# Altium project AI Gateway - Carrier.PrjPcb (part 1 of 2)
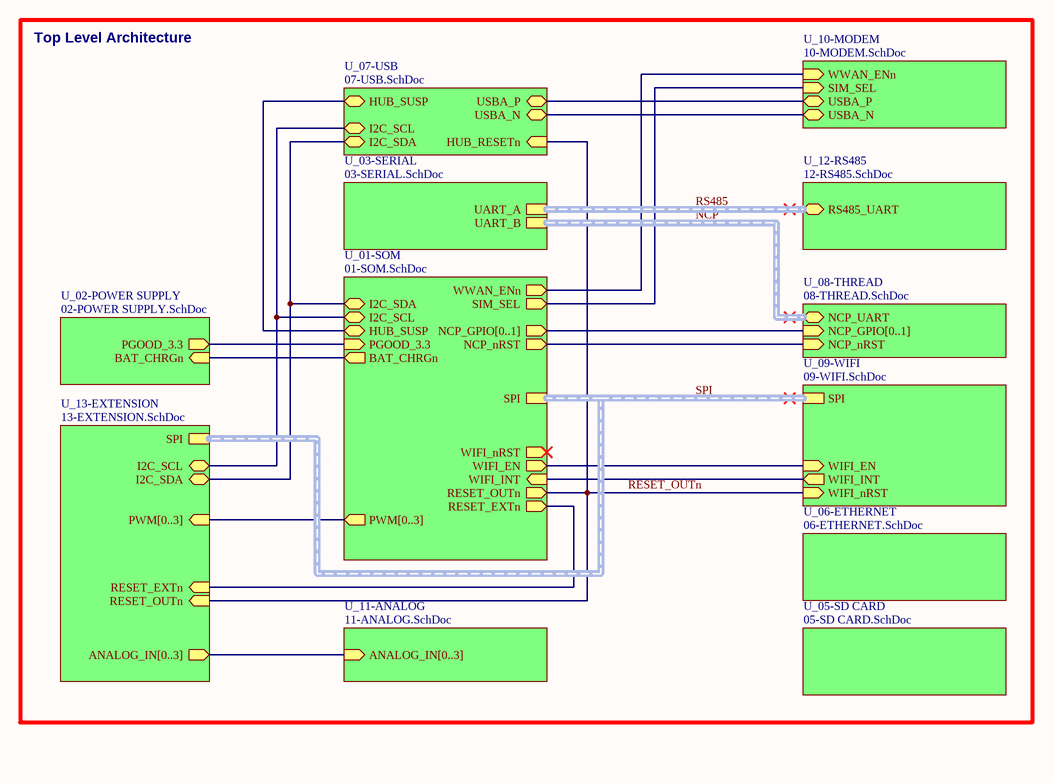
[diagram p0: 00-ARCHITECTURE.SchDoc]
Revision: A
13 sheets, 246 parts. Net scope: hierarchical (ports join the sheet entries above them; power ports are global).
Board file: AI Gateway - Carrier.PcbDoc
Sheets:
  00-ARCHITECTURE.SchDoc
    U_06-ETHERNET = 06-ETHERNET.SchDoc
    U_07-USB = 07-USB.SchDoc
    U_02-POWER SUPPLY = 02-POWER SUPPLY.SchDoc
    U_08-THREAD = 08-THREAD.SchDoc
    U_09-WIFI = 09-WIFI.SchDoc
    U_10-MODEM = 10-MODEM.SchDoc
    U_12-RS485 = 12-RS485.SchDoc
    U_05-SD CARD = 05-SD CARD.SchDoc
    U_03-SERIAL = 03-SERIAL.SchDoc
    U_01-SOM = 01-SOM.SchDoc
    U_11-ANALOG = 11-ANALOG.SchDoc
    U_13-EXTENSION = 13-EXTENSION.SchDoc

## Sheet 00-ARCHITECTURE.SchDoc
size A4

### Sub-sheets
U_01-SOM = 01-SOM.SchDoc: PWM[0..3] (out), RESET_OUTn (out), WIFI_nRST (out), WIFI_INT (in), WWAN_ENn (out), SIM_SEL (out), NCP_nRST (out), WIFI_EN (out), SPI (harness SPI), NCP_GPIO[0..1] (out), I2C_SDA (bidir), I2C_SCL (bidir), RESET_EXTn (out), HUB_SUSP (bidir), BAT_CHRGn (out), PGOOD_3.3 (in)
U_02-POWER SUPPLY = 02-POWER SUPPLY.SchDoc: PGOOD_3.3 (out), BAT_CHRGn (in)
U_03-SERIAL = 03-SERIAL.SchDoc: UART_A (harness UART), UART_B (harness UART)
U_05-SD CARD = 05-SD CARD.SchDoc: no entries
U_06-ETHERNET = 06-ETHERNET.SchDoc: no entries
U_07-USB = 07-USB.SchDoc: USBA_P (bidir), USBA_N (bidir), HUB_SUSP (bidir), HUB_RESETn (in), I2C_SDA (bidir), I2C_SCL (bidir)
U_08-THREAD = 08-THREAD.SchDoc: NCP_GPIO[0..1] (in), NCP_nRST (in), NCP_UART (bidir, harness UART)
U_09-WIFI = 09-WIFI.SchDoc: WIFI_nRST (in), WIFI_INT (out), WIFI_EN (in), SPI (harness SPI)
U_10-MODEM = 10-MODEM.SchDoc: USBA_P (bidir), USBA_N (bidir), SIM_SEL (in), WWAN_ENn (in)
U_11-ANALOG = 11-ANALOG.SchDoc: ANALOG_IN[0..3] (in)
U_12-RS485 = 12-RS485.SchDoc: RS485_UART (bidir, harness UART)
U_13-EXTENSION = 13-EXTENSION.SchDoc: RESET_OUTn (in), SPI (harness SPI), I2C_SDA (bidir), PWM[0..3] (in), RESET_EXTn (in), I2C_SCL (bidir), ANALOG_IN[0..3] (out)

### Nets
BAT_CHRGn: sheet U_02-POWER SUPPLY/BAT_CHRGn, sheet U_01-SOM/BAT_CHRGn
HUB_SUSP: sheet U_07-USB/HUB_SUSP, sheet U_01-SOM/HUB_SUSP
I2C_SCL: sheet U_07-USB/I2C_SCL, sheet U_01-SOM/I2C_SCL, sheet U_13-EXTENSION/I2C_SCL
I2C_SDA: sheet U_07-USB/I2C_SDA, sheet U_01-SOM/I2C_SDA, sheet U_13-EXTENSION/I2C_SDA
NCP_nRST: sheet U_08-THREAD/NCP_nRST, sheet U_01-SOM/NCP_nRST
PGOOD_3.3: sheet U_02-POWER SUPPLY/PGOOD_3.3, sheet U_01-SOM/PGOOD_3.3
RESET_EXTn: sheet U_01-SOM/RESET_EXTn, sheet U_13-EXTENSION/RESET_EXTn
RESET_OUTn: sheet U_07-USB/HUB_RESETn, sheet U_09-WIFI/WIFI_nRST, sheet U_01-SOM/RESET_OUTn, sheet U_13-EXTENSION/RESET_OUTn
SIM_SEL: sheet U_10-MODEM/SIM_SEL, sheet U_01-SOM/SIM_SEL
USBA_N: sheet U_07-USB/USBA_N, sheet U_10-MODEM/USBA_N
USBA_P: sheet U_07-USB/USBA_P, sheet U_10-MODEM/USBA_P
WIFI_EN: sheet U_09-WIFI/WIFI_EN, sheet U_01-SOM/WIFI_EN
WIFI_INT: sheet U_09-WIFI/WIFI_INT, sheet U_01-SOM/WIFI_INT
WWAN_ENn: sheet U_10-MODEM/WWAN_ENn, sheet U_01-SOM/WWAN_ENn

### Buses and harness runs
bus sheet U_01-SOM/NCP_GPIO[0..1] = sheet U_08-THREAD/NCP_GPIO[0..1]
bus sheet U_01-SOM/PWM[0..3] = sheet U_13-EXTENSION/PWM[0..3]
bus sheet U_11-ANALOG/ANALOG_IN[0..3] = sheet U_13-EXTENSION/ANALOG_IN[0..3]
harness NCP = sheet U_03-SERIAL/UART_B = sheet U_08-THREAD/NCP_UART
harness RS485 = sheet U_03-SERIAL/UART_A = sheet U_12-RS485/RS485_UART
harness SPI = sheet U_01-SOM/SPI = sheet U_09-WIFI/SPI = sheet U_13-EXTENSION/SPI

### Notes on the sheet
- Top Level Architecture

## Sheet 06-ETHERNET.SchDoc
size A4
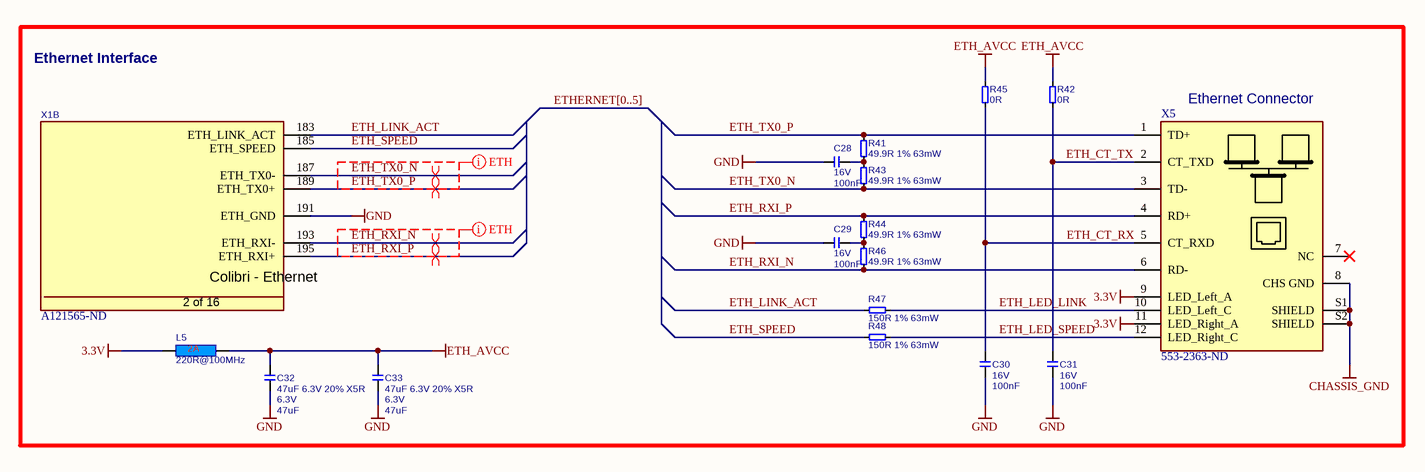
[diagram p1: 06-ETHERNET.SchDoc]

### Parts
C28  value 100nF  Rating: 16V  [CAPC1005X60N]  (hidden comment: 100nF 16V 10% X7R)
C29  value 100nF  Rating: 16V  [CAPC1005X60N]  (hidden comment: 100nF 16V 10% X7R)
C30  value 100nF  Rating: 16V  [CAPC1005X60N]  (hidden comment: 100nF 16V 10% X7R)
C31  value 100nF  Rating: 16V  [CAPC1005X60N]  (hidden comment: 100nF 16V 10% X7R)
C32  47uF 6.3V 20% X5R  value 47uF  Rating: 6.3V  [T_CAPC0603X33N]
C33  47uF 6.3V 20% X5R  value 47uF  Rating: 6.3V  [T_CAPC0603X33N]
L5  value 220R@100MHz  [INDC2012X140N]  (hidden comment: BLM21PG221SN1D)
R41  49.9R 1% 63mW  [RESC1005X40N]
R42  0R  [RESC1005X40N]
R43  49.9R 1% 63mW  [RESC1005X40N]
R44  49.9R 1% 63mW  [RESC1005X40N]
R45  0R  [RESC1005X40N]
R46  49.9R 1% 63mW  [RESC1005X40N]
R47  150R 1% 63mW  [RESC1005X40N]
R48  150R 1% 63mW  [RESC1005X40N]
X1  Supplier Part Number 1: A121565-ND  [T_Tyco_1473005-1]  (hidden comment: 1473005-1)  (part B of 16)
X5  Supplier Part Number 1: 553-2363-ND  [T_PULSE_JD2-0001NL]  (hidden comment: JD2-0001NL)

### Nets
3.3V: L5.2 X5.9(LED_Left_A) X5.11(LED_Right_A)
CHASSIS_GND: X5.8(CHS_GND) X5.S1(SHIELD) X5.S2(SHIELD)
ETH_AVCC: C32.2 C33.2 L5.1 R42.2 R45.2
GND: C28.2 C29.2 C30.1 C31.1 C32.1 C33.1 X1.191(ETH_GND)
ETH_CT_RX: C30.2 R45.1 X5.5(CT_RXD)
ETH_CT_TX: C31.2 R42.1 X5.2(CT_TXD)
ETH_LED_LINK: R47.1 X5.10(LED_Left_C)
ETH_LED_SPEED: R48.1 X5.12(LED_Right_C)
ETH_LINK_ACT: R47.2 X1.183(ETH_LINK_ACT)
ETH_RXI_N: R46.1 X1.193(ETH_RXI-) X5.6(RD-)
ETH_RXI_P: R44.2 X1.195(ETH_RXI+) X5.4(RD+)
ETH_SPEED: R48.2 X1.185(ETH_SPEED)
ETH_TX0_N: R43.1 X1.187(ETH_TX0-) X5.3(TD-)
ETH_TX0_P: R41.2 X1.189(ETH_TX0+) X5.1(TD+)
NetC28_1: C28.1 R41.1 R43.2
NetC29_1: C29.1 R44.1 R46.2

Not connected (* = marked no-connect by the designer): X5 7(NC)*

### Buses and harness runs
bus ETHERNET[0..5]

### Layout directives
differential pair: ETH_RXI_N, ETH_RXI_P, ETH_TX0_N, ETH_TX0_P
net class USB: ETH_RXI_N, ETH_RXI_P, ETH_TX0_N, ETH_TX0_P

### Notes on the sheet
- Ethernet Interface
- (near X5) Ethernet Connector
- (in symbol CON-Tyco-1473005-1-200-0.6mm, part B) Colibri - Ethernet; 2 of 16
- (in symbol L-Murata-220R@100MHz-2A-0805) 2A

### Library data of the parts
C28-C31 = C-100nF-16V-10%-0603: Capacitor Ceramic X7R 100nF 16V 10% 0603; FP_DESC: C0402; Tolerance: 10%; Type: X7R; Supplier 1: Digi-Key; Supplier Part Number 1: 1276-1001-1-ND; Footprint Checked: -; MFG: *; MFG_PN: *
C32 C33 = C-47uF-6.3V-20%-0603: Capacitor Ceramic X5R 47uF 6.3V 20% 0603; FP_DESC: C0603; Tolerance: 20%; Type: X5R; Supplier 1: Digi-Key; Supplier Part Number 1: 490-13247-1-ND; MFG: *; MFG_PN: *
L5 = L-Murata-220R@100MHz-2A-0805: 220 Ohms @ 100MHz 1 Power Line Ferrite Bead 0805 (2012 Metric) 2A 45mOhm; Rating: 4A; Tolerance: 25%; MFG: EXC-ML20A390U; Supplier 1: Digi-Key; Supplier Part Number 1: 490-1054-1-ND; Footprint Checked: -; Symbol Checked: -
R41 R43 R44 R46 = R-49.9R-1%-0402: Resistor 49.9ohm 63mW 1% 0402; Manufacturer: <GENERIC>; Value: 49.9; Replacement Allowed: Yes; Power: 63mW; Tolerance: 1%; Footprint: R0402; Supplier 1: Digi-Key; Supplier Part Number 1: 541-49.9LCT-ND; Manufacturer Part Number: <GENERIC>
R42 R45 = R-0R-0402: Resistor 0ohm 0402; Tolerance: 1%; MFG: <GENERIC>; Power: ?; Value: 0R; Footprint: R0402; Supplier 1: Digi-Key; Supplier Part Number 1: 541-2952-1-ND; Footprint Checked: -; Symbol Checked: -; MFG_PN: <GENERIC>
R47 R48 = R-150R-1%-0402: Resistor 150ohm 63mW 1% 0402; MFG: <GENERIC>; Power: 63mW; Tolerance: 1%; Footprint: R0402; Value: 150R; Supplier 1: Digi-Key; Supplier Part Number 1: 541-CRCW0402150RFKTDCT-ND; Footprint Checked: -; Symbol Checked: -; MFG_PN: <GENERIC>
X1 = CON-Tyco-1473005-1-200-0.6mm: SODIMM Connector; Manufacturer Name: Tyco; No. of ways: 200; Supplier 1: Digi-Key; Manufacturer Part No.: 1473005-1
X5 = CON-Pulse-JD2-0001NL: 1 Port RJ45 Magjack Connector Through Hole 10/100 Base-TX, AutoMDIX; MFG: Pulse Electronics Network; MFG_PN: J00-0065NL; Footprint Checked: -; Symbol Checked: -; Supplier 1: Digi-Key

## Sheet 07-USB.SchDoc
size B
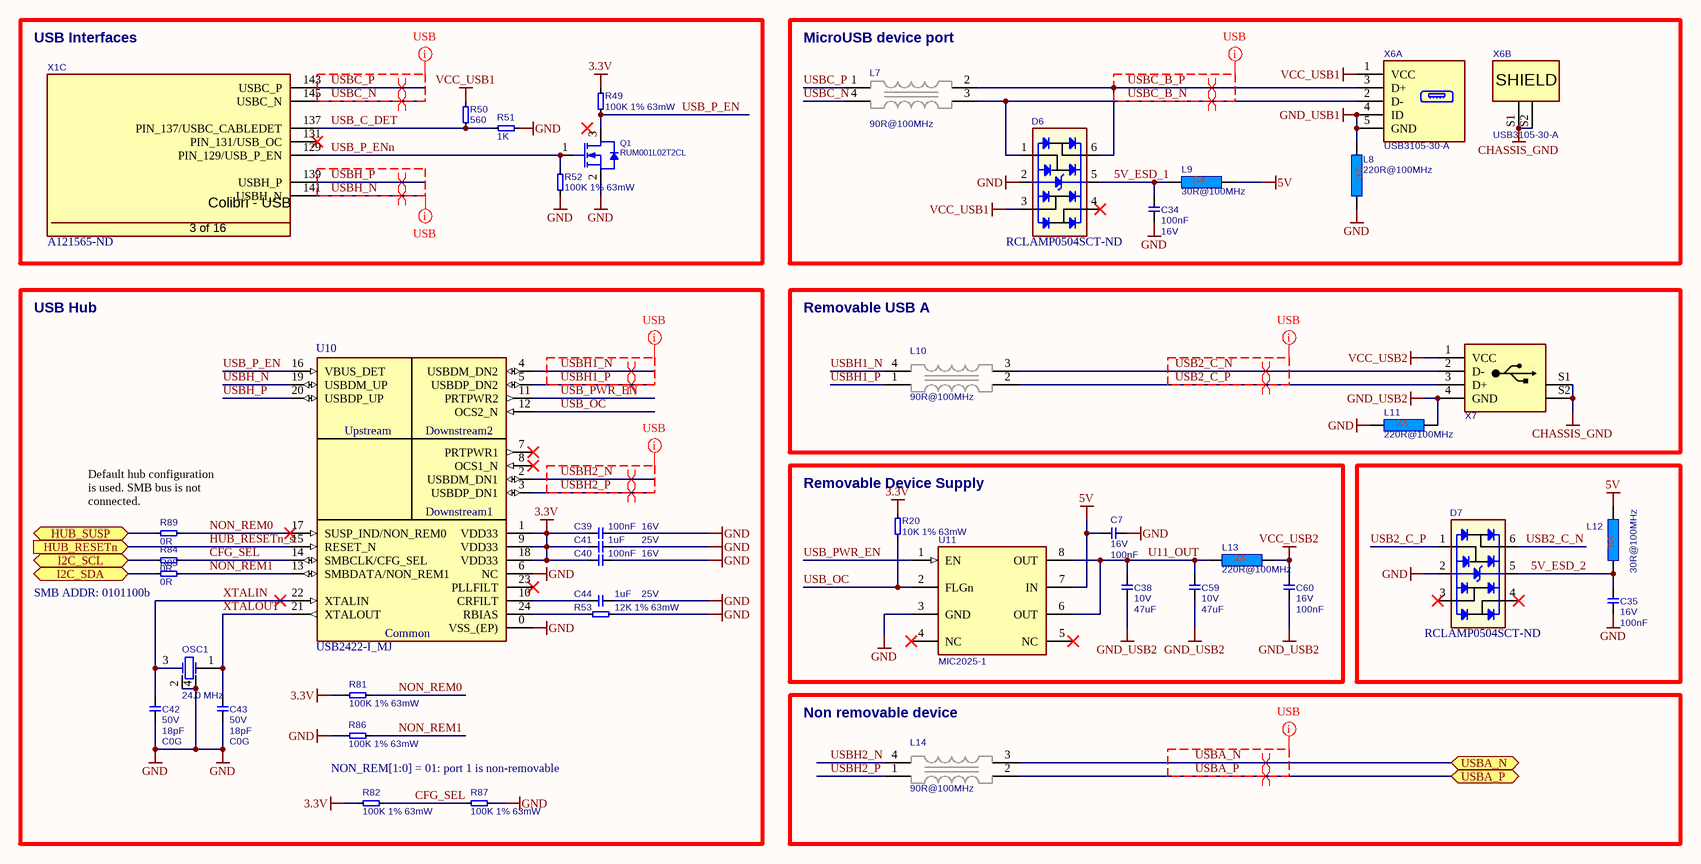
[diagram p2: 07-USB.SchDoc]

### Parts
C7  value 100nF  Rating: 16V  [CAPC1005X60N]  (hidden comment: 100nF 16V 10% X7R)
C34  value 100nF  Rating: 16V  [CAPC1005X60N]  (hidden comment: 100nF 16V 10% X7R)
C35  value 100nF  Rating: 16V  [CAPC1005X60N]  (hidden comment: 100nF 16V 10% X7R)
C38  value 47uF  Rating: 10V  [CAPC3225X160N]  (hidden comment: 47uF 10V 20% X5R)
C39  value 100nF  Rating: 16V  [CAPC1005X60N]  (hidden comment: 100nF 16V 10% X7R)
C40  value 100nF  Rating: 16V  [CAPC1005X60N]  (hidden comment: 100nF 16V 10% X7R)
C41  value 1uF  Rating: 25V  [T_CAPC0805X125N]  (hidden comment: 1uF 25V 10% X7R)
C42  value 18pF  Rating: 50V  Type: C0G  [T_CAPC0603X33N]  (hidden comment: 18pF 50V 5% C0G)
C43  value 18pF  Rating: 50V  Type: C0G  [T_CAPC0603X33N]  (hidden comment: 18pF 50V 5% C0G)
C44  value 1uF  Rating: 25V  [T_CAPC0805X125N]  (hidden comment: 1uF 25V 10% X7R)
C59  value 47uF  Rating: 10V  [CAPC3225X160N]  (hidden comment: 47uF 10V 20% X5R)
C60  value 100nF  Rating: 16V  [CAPC1005X60N]  (hidden comment: 100nF 16V 10% X7R)
D6  Supplier Part Number 1: RCLAMP0504SCT-ND  [T_SOT95P285X90-6N]  (hidden comment: RCLAMP0504S)
D7  Supplier Part Number 1: RCLAMP0504SCT-ND  [T_SOT95P285X90-6N]  (hidden comment: RCLAMP0504S)
L7  value 90R@100MHz  [T_Murata_DLW21SN900SQ2]  (hidden comment: DLW21SN900SQ2)
L8  value 220R@100MHz  [INDC2012X140N]  (hidden comment: BLM21PG221SN1D)
L9  value 30R@100MHz  [INDC1608X95N]  (hidden comment: BLM18KG300TN1D)
L10  value 90R@100MHz  [T_Murata_DLW21SN900SQ2]  (hidden comment: DLW21SN900SQ2)
L11  value 220R@100MHz  [INDC2012X140N]  (hidden comment: BLM21PG221SN1D)
L12  value 30R@100MHz  [INDC1608X95N]  (hidden comment: BLM18KG300TN1D)
L13  value 220R@100MHz  [INDC2012X140N]  (hidden comment: BLM21PG221SN1D)
L14  value 90R@100MHz  [T_Murata_DLW21SN900SQ2]  (hidden comment: DLW21SN900SQ2)
OSC1  value 24.0 MHz  [XTAL3.2x2.5]  (hidden comment: CRYSTAL 24.0000MHZ 18PF SMD)
Q1  RUM001L02T2CL  [TRANS_RUM001_ROM]
R20  10K 1% 63mW  [RESC1005X40N]
R49  100K 1% 63mW  [RESC1005X40N]
R50  value 560  [RESC1005X40N]  (hidden comment: 560R 1% 63mW)
R51  value 1K  [RESC1005X40N]  (hidden comment: 1K 1% 63mW)
R52  100K 1% 63mW  [RESC1005X40N]
R53  12K 1% 63mW  [RESC1005X40N]
R81  100K 1% 63mW  [RESC1005X40N]
R82  100K 1% 63mW  [RESC1005X40N]
R84  0R  [RESC1005X40N]
R85  0R  [RESC1005X40N]
R86  100K 1% 63mW  [RESC1005X40N]
R87  100K 1% 63mW  [RESC1005X40N]
R89  0R  [RESC1005X40N]
U10  USB2422-I_MJ  [QFN50P400X400X80-25N]
U11  MIC2025-1  [SOIC127P600X175-8N]
X1  Supplier Part Number 1: A121565-ND  [T_Tyco_1473005-1]  (hidden comment: 1473005-1)  (part C of 16)
X6  USB3105-30-A  [T_GCT_USB3105-30-A]  (parts A,B of 2)
X7  UE27AE54100  [T_FCI_UE27AE54100]  (value not drawn)

### Blocks framed on the sheet
USB Interfaces: Q1 R49-R52 X1
MicroUSB device port: C34 D6 L7-L9 X6
USB Hub: C39-C44 OSC1 R53 R81 R82 R84-R87 R89 U10
Removable USB A: L10 L11 X7
Removable Device Supply: C7 C38 C59 C60 L13 R20 U11
Non removable device: L14

### Ports
HUB_RESETn (in), HUB_SUSP (bidir), I2C_SCL (bidir), I2C_SDA (bidir), USBA_N (bidir), USBA_P (bidir)

### Nets
3.3V: C39.2 C40.2 C41.2 R20.1 R49.2 R81.2 R82.2 U10.1(VDD33) U10.9(VDD33) U10.18(VDD33)
5V: C7.2 L9.1 L12.1 U11.7(IN)
CHASSIS_GND: X6.S1(SHIELD) X6.S2(SHIELD) X7.S1 X7.S2
GND: C7.1 C34.1 C35.1 C39.1 C40.1 C41.1 C42.1 C43.1 C44.1 D6.2 D7.2 L8.1 L11.2 OSC1.2 OSC1.4 Q1.2(D) R51.2 R52.2 R53.2 R86.1 R87.1 U10.0(VSS_(EP)) U10.6(NC) U11.3(GND)
GND_USB1: L8.2 X6.4(ID) X6.5(GND)
GND_USB2: C38.1 C59.1 C60.1 L11.1 X7.4(GND)
VCC_USB1: D6.3 R50.1 X6.1(VCC)
VCC_USB2: C60.2 L13.1 X7.1(VCC)
5V_ESD_1: C34.2 D6.5 L9.2
5V_ESD_2: C35.2 D7.5 L12.2
CFG_SEL: R82.1 R84.1 R87.2 U10.14(SMBCLK/CFG_SEL)
HUB_RESETn_s: U10.15(RESET_N) ; port HUB_RESETn  [project net RESET_OUTn]
HUB_SUSP: R89.2 ; port HUB_SUSP
I2C_SCL: R84.2 ; port I2C_SCL
I2C_SDA: R85.2 ; port I2C_SDA
NON_REM0: R81.1 R89.1 U10.17(SUSP_IND/NON_REM0)
NON_REM1: R85.1 R86.2 U10.13(SMBDATA/NON_REM1)
U11_OUT: C38.2 C59.2 L13.2 U11.6(OUT) U11.8(OUT)
USB2_C_N: D7.6 L10.3 X7.2(D-)
USB2_C_P: D7.1 L10.2 X7.3(D+)
USB_C_DET: R50.2 R51.1 X1.137(PIN_137/USBC_CABLEDET)
USB_OC: R20.2 U10.12(OCS2_N) U11.2(FLGn)
USB_P_EN: Q1.3(S) R49.1 U10.16(VBUS_DET)
USB_P_ENn: Q1.1(G) R52.1 X1.129(PIN_129/USB_P_EN)
USB_PWR_EN: U10.11(PRTPWR2) U11.1(EN)
USBA_N: L14.3 ; port USBA_N
USBA_P: L14.2 ; port USBA_P
USBC_B_N: D6.1 L7.3 X6.2(D-)
USBC_B_P: D6.6 L7.2 X6.3(D+)
USBC_N: L7.4 X1.145(USBC_N)
USBC_P: L7.1 X1.143(USBC_P)
USBH1_N: L10.4 U10.4(USBDM_DN2)
USBH1_P: L10.1 U10.5(USBDP_DN2)
USBH2_N: L14.4 U10.2(USBDM_DN1)
USBH2_P: L14.1 U10.3(USBDP_DN1)
USBH_N: U10.19(USBDM_UP) X1.141(USBH_N)
USBH_P: U10.20(USBDP_UP) X1.139(USBH_P)
XTALIN: C42.2 OSC1.3(OSC2) U10.22(XTALIN)
XTALOUT: C43.2 OSC1.1(OSC1) U10.21(XTALOUT)
NetC44_2: C44.2 U10.10(CRFILT)
NetR53_1: R53.1 U10.24(RBIAS)

Not connected (* = marked no-connect by the designer): D6 4*; D7 3* 4*; U10 7(PRTPWR1)* 8(OCS1_N)* 23(PLLFILT)*; U11 4(NC)* 5(NC)*; X1 131(PIN_131/USB_OC)*

### Layout directives
differential pair: USB2_C_N, USB2_C_P, USBA_N, USBA_P, USBC_B_N, USBC_B_P, USBC_N, USBC_P, USBH1_N, USBH1_P, USBH2_N, USBH2_P, USBH_N, USBH_P
net class USB: USB2_C_N, USB2_C_P, USBA_N, USBA_P, USBC_B_N, USBC_B_P, USBC_N, USBC_P, USBH1_N, USBH1_P, USBH2_N, USBH2_P, USBH_N

### Notes on the sheet
- (near R89) Default hub configuration is used. SMB bus is not connected.
- SMB ADDR: 0101100b
- NON_REM[1:0] = 01: port 1 is non-removable
- (in symbol CON-Tyco-1473005-1-200-0.6mm, part C) Colibri - USB; 3 of 16
- (in symbol IC-Microchip-USB2422-I_MJ) Upstream; Downstream2; Downstream1; Common
- (in symbol L-Murata-30R@100MHz-5A-0603) 5A
- (in symbol L-Murata-220R@100MHz-2A-0805) 2A

### Library data of the parts
C7 C34 C35 C39 C40 C60 = C-100nF-16V-10%-0603: as C28 on sheet 06-ETHERNET; Tolerance: 10%; Type: X7R; Supplier 1: Digi-Key; Supplier Part Number 1: 1276-1001-1-ND; Footprint Checked: -; MFG: *; MFG_PN: *
C38 C59 = C-47uF-10V-20%-1210: Capacitor Ceramic X5R 47uF 10V 20% 1210; FP_DESC: C1210; Tolerance: 20%; Type: X5R; Supplier 1: Digi-Key; Supplier Part Number 1: 445-6711-1-ND; MFG: *; MFG_PN: *
C41 C44 = C-1uF-25V-10%-0805: Capacitor Ceramic X7R 1uF 25V 10% 0805; FP_DESC: C0805; Tolerance: 10%; Type: X7R; Supplier 1: Digi-Key; Supplier Part Number 1: 399-8004-1-ND; MFG: *; MFG_PN: *
C42 C43 = C-18pF-50V-5%-0603: Capacitor Ceramic C0G 18pF 50V 5% 0603; FP_DESC: C0603; Tolerance: 5%; Supplier 1: Digi-Key; Supplier Part Number 1: 311-1061-1-ND; MFG: *; MFG_PN: *
D6 D7 = D-Semtech-RClamp0504S: TVS Array low cap; Supplier 1: Digi-Key; Footprint Checked: -; MFG: Semtech; MFG_PN: RCLAMP0504S; Symbol Checked: -
L7 L10 L14 = L-Murata-DLW21SN900SQ2-90R@100MHz-330mA-25%: Common Mode Choke High Speed 90R 330mA; Tolerance: 25%; MFG: Murata; Rating: 330mA; Supplier 1: Digi-Key; Supplier Part Number 1: 490-5137-1-ND; Footprint Checked: -; MFG_PN: DLW21SN900SQ2; Symbol Checked: -
L8 L11 L13 = L-Murata-220R@100MHz-2A-0805: as L5 on sheet 06-ETHERNET; Supplier 1: Digi-Key; Supplier Part Number 1: 490-1054-1-ND; Footprint Checked: -; Symbol Checked: -
L9 L12 = L-Murata-30R@100MHz-5A-0603: 30 Ohms @ 100MHz 1 Power Line Ferrite Bead 0603 (1608 Metric) 5A 10mOhm; Rating: 4A; Tolerance: 25%; MFG: EXC-ML20A390U; Supplier 1: Digi-Key; Supplier Part Number 1: 490-5447-1-ND; Footprint Checked: Ok, Assign Ok; Symbol Checked: -
OSC1 = OSC-ABM8G-24.000MHZ-18-D2Y-T: 24MHz ±20ppm Crystal 18pF 60 Ohms 4-SMD, No Lead; Tolerance: 30ppm; MFG: HORIZON; MFG_PN: HEX24-24000MHz-18-50R-F-H2-T2-W2-T; Supplier 1: Digi-Key; Supplier Part Number 1: 535-10273-1-ND; Footprint Checked: -; Symbol Checked: -
Q1 = T-Rohm-RUM001L02T2CL: N-Channel 20V 100mA (Ta) 150mW (Ta) Surface Mount VMT3; FP_DESC: SOT-723; MFG: Rohm Semiconductor Inc.; MFG_PN: RUM001L02T2CL; Footprint Checked: Ok; Supplier 1: Digi-Key; Supplier Part Number 1: RUM001L02T2CLCT-ND; Symbol Checked: -
R20 = R-10K-1%-0402: Resistor 10Kohm 63mW 1% 0402; MFG: <GENERIC>; Power: 63mW; Tolerance: 1%; Value: 10k; Footprint: R0402; Supplier 1: Digi-Key; Supplier Part Number 1: 541-10.0KLDKR-ND; Footprint Checked: -; MFG_PN: <GENERIC>; Symbol Checked: -
R49 R52 R81 R82 R86 R87 = R-100K-1%-0402: Resistor 100Kohm 63mW 1% 0402; Manufacturer: <GENERIC>; Replacement Allowed: Yes; Power: 63mW; Tolerance: 1%; Value: 100k; Footprint: R0402; Supplier 1: Digi-Key; Supplier Part Number 1: 541-100KLCT-ND; Manufacturer Part Number: <GENERIC>
R50 = R-560R-1%-0402: Resistor 560ohm 63mW 1% 0402; MFG: <GENERIC>; Tolerance: 1%; Power: 63mW; Footprint: R0402; Supplier 1: Digi-Key; Supplier Part Number 1: 13-AC0402FR-07560RLCT-ND; Footprint Checked: -; MFG_PN: <GENERIC>; Symbol Checked: -
R51 = R-1K-1%-0402: Resistor 1Kohm 63mW 1% 0402; MFG: <GENERIC>; Tolerance: 1%; Power: 63mW; Footprint: R0402; Supplier 1: Digi-Key; Supplier Part Number 1: 541-1.00KLCT-ND; Footprint Checked: -; MFG_PN: <GENERIC>; Symbol Checked: -
R53 = R-12K-1%-0402: Resistor 12Kohm 63mW 1% 0402; MFG: <GENERIC>; Symbol Checked: T; Tolerance: 1%; Value: 12K; Power: 63mW; Footprint: R0402; Supplier 1: Digi-Key; Supplier Part Number 1: 541-4063-1-ND; Footprint Checked: -; MFG_PN: <GENERIC>
R84 R85 R89 = R-0R-0402: as R42 on sheet 06-ETHERNET; Power: ?; Value: 0R; Footprint: R0402; Supplier 1: Digi-Key; Supplier Part Number 1: 541-2952-1-ND; Footprint Checked: -; MFG_PN: <GENERIC>; Symbol Checked: -
U10 = IC-Microchip-USB2422-I_MJ: USB Hub Controller USB 2.0 USB Interface 24-QFN (4x4); Supplier 1: Digi-Key; Supplier Part Number 1: USB2422-I/MJ-ND; Footprint Checked: -; Symbol Checked: -
U11 = IC-Microchip-MIC2025-1: Power Switch/Driver 1:1 N-Channel 500mA 8-MSOP; Symbol Checked: T; MFG: Texas Instruments; Supplier 1: Digi-Key; Supplier Part Number 1: MIC2025-1YM-CT-ND; Footprint Checked: -; MFG_PN: MIC2025
X1 = CON-Tyco-1473005-1-200-0.6mm: as X1 on sheet 06-ETHERNET; Supplier 1: Digi-Key; Manufacturer Part No.: 1473005-1
X6 = CON-GCT-USB3105-30-A: Micro USB OTG Connector - TH - Vertical; No. of ways: 5; MFG: GCT; Supplier 1: Digi-Key; Supplier Part Number 1: 2073-USB3105-30-ACT-ND; Footprint Checked: -; MFG_PN: USB3105-30-A; Symbol Checked: -
X7 = CON-FCI-UE27AE54100: USB Type A Connector; Manufacturer Name: FCI; No. of ways: 4; Supplier 1: Digi-Key; Supplier Part Number 1: UE27AE54100-ND; Manufacturer Part No.: UE27AE54100

## Sheet 02-POWER SUPPLY.SchDoc
size A4
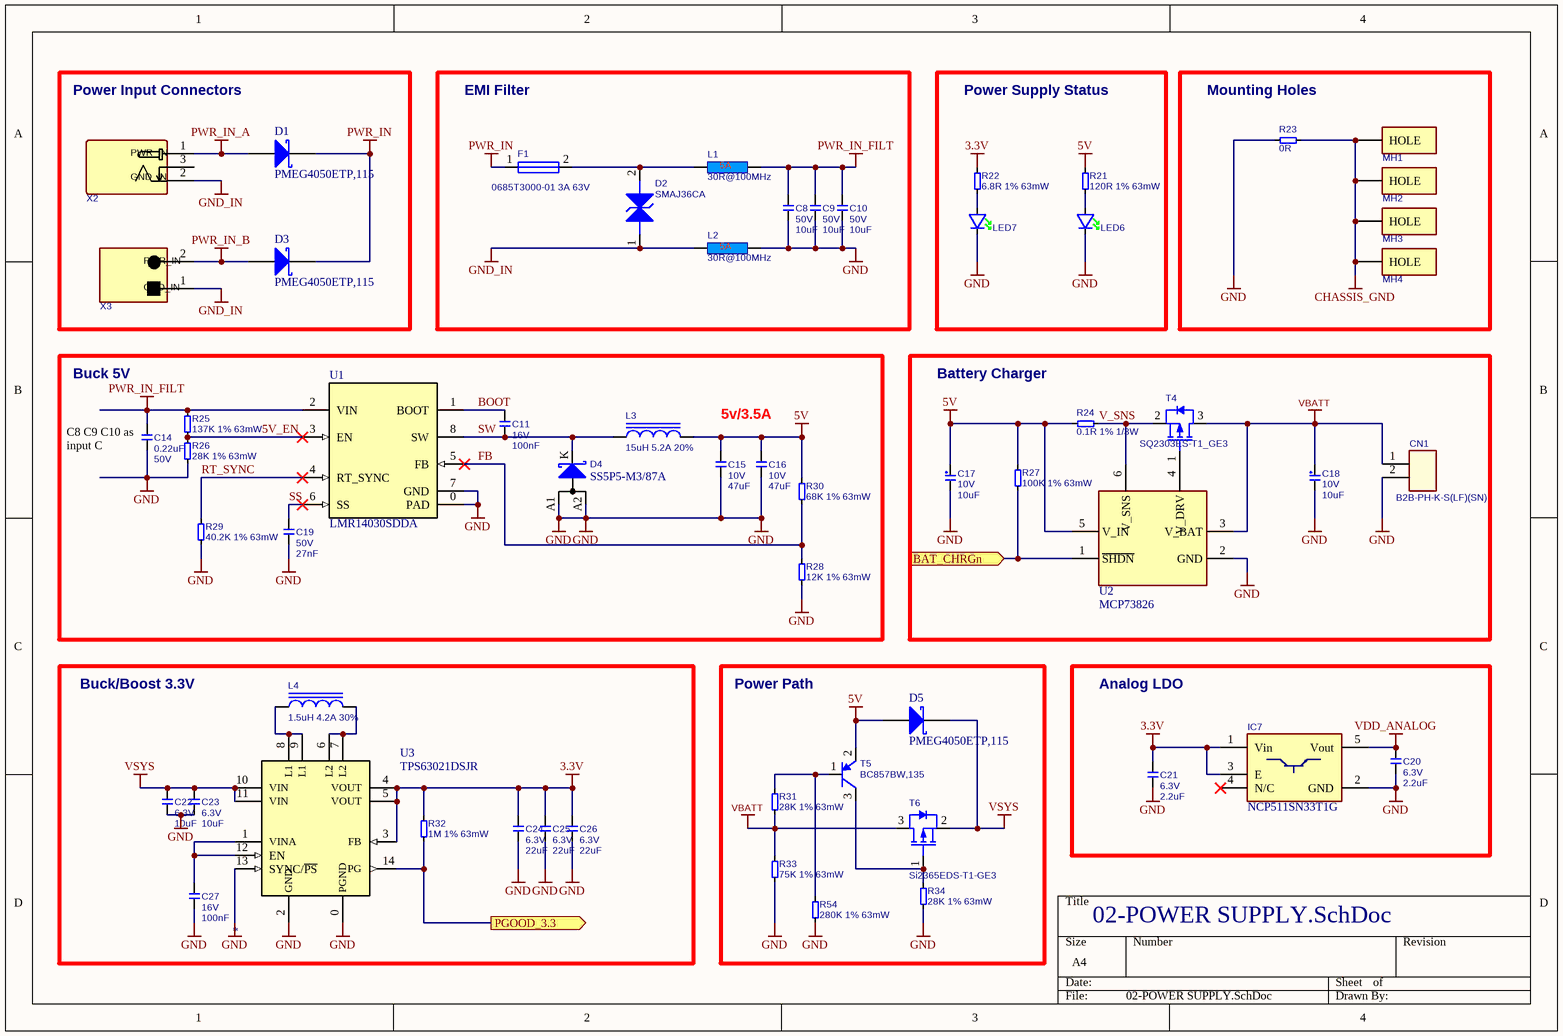
[diagram p3: 02-POWER SUPPLY.SchDoc]

### Parts
C8  value 10uF  Rating: 50V  [CAPC3225X160N]  (hidden comment: 10uF 50V 20% X5R)
C9  value 10uF  Rating: 50V  [CAPC3225X160N]  (hidden comment: 10uF 50V 20% X5R)
C10  value 10uF  Rating: 50V  [CAPC3225X160N]  (hidden comment: 10uF 50V 20% X5R)
C11  value 100nF  Rating: 16V  [CAPC1005X60N]  (hidden comment: 100nF 16V 10% X7R)
C14  value 0.22uF  Rating: 50V  [T_CAPC0805X125N]  (hidden comment: 0.22uF 50V 10% X7R)
C15  value 47uF  Rating: 10V  [CAPC3225X160N]  (hidden comment: 47uF 10V 20% X5R)
C16  value 47uF  Rating: 10V  [CAPC3225X160N]  (hidden comment: 47uF 10V 20% X5R)
C17  value 10uF  Rating: 10V  [T_CAPC1206X180N]  (hidden comment: 10uF 10V 20% Tantalum)
C18  value 10uF  Rating: 10V  [T_CAPC1206X180N]  (hidden comment: 10uF 10V 20% Tantalum)
C19  value 27nF  Rating: 50V  [T_CAPC0603X33N]  (hidden comment: 27nF 50V 20% X7R)
C20  value 2.2uF  Rating: 6.3V  [T_CAPC0603X33N]  (hidden comment: 2.2uF 6.3V 20% X5R)
C21  value 2.2uF  Rating: 6.3V  [T_CAPC0603X33N]  (hidden comment: 2.2uF 6.3V 20% X5R)
C22  value 10uF  Rating: 6.3V  [T_CAPC0603X33N]  (hidden comment: 10uF 6.3V 20% X5R)
C23  value 10uF  Rating: 6.3V  [T_CAPC0603X33N]  (hidden comment: 10uF 6.3V 20% X5R)
C24  value 22uF  Rating: 6.3V  [T_CAPC0603X33N]  (hidden comment: 22uF 6.3V 20% X5R)
C25  value 22uF  Rating: 6.3V  [T_CAPC0603X33N]  (hidden comment: 22uF 6.3V 20% X5R)
C26  value 22uF  Rating: 6.3V  [T_CAPC0603X33N]  (hidden comment: 22uF 6.3V 20% X5R)
C27  value 100nF  Rating: 16V  [CAPC1005X60N]  (hidden comment: 100nF 16V 10% X7R)
CN1  B2B-PH-K-S(LF)(SN)  [B2B-PH-K-S(LF)(SN) - duplicate]
D1  PMEG4050ETP,115  [D_SOD128]
D2  SMAJ36CA  [T_LITTLEFUSE_SMAJ30CA]
D3  PMEG4050ETP,115  [D_SOD128]
D4  SS5P5-M3/87A  [T_DIOM_TO277A]
D5  PMEG4050ETP,115  [D_SOD128]
F1  0685T3000-01 3A 63V  [RESC3216N]
IC7  NCP511SN33T1G  [SOT95P279X142-5N]
L1  value 30R@100MHz  [INDC1608X95N]  (hidden comment: BLM18KG300TN1D)
L2  value 30R@100MHz  [INDC1608X95N]  (hidden comment: BLM18KG300TN1D)
L3  15uH 5.2A 20%  [T_INDM125125X80N]
L4  1.5uH 4.2A 30%  [L_NR6028]
LED6  150060GS75000  [LEDC1608X80N]  (value not drawn)
LED7  150060GS75000  [LEDC1608X80N]  (value not drawn)
MH1  MECH-MountingHoles  [T_MountingHoles]  (value not drawn)  (no BOM)
MH2  MECH-MountingHoles  [T_MountingHoles]  (value not drawn)  (no BOM)
MH3  MECH-MountingHoles  [T_MountingHoles]  (value not drawn)  (no BOM)
MH4  MECH-MountingHoles  [T_MountingHoles]  (value not drawn)  (no BOM)
R21  120R 1% 63mW  [RESC1005X40N]
R22  6.8R 1% 63mW  [RESC1005X40N]
R23  0R  [RESC1005X40N]
R24  0.1R 1% 1/3W  [RESC1608N]
R25  137K 1% 63mW  [RESC1005X40N]
R26  28K 1% 63mW  [RESC1005X40N]
R27  100K 1% 63mW  [RESC1005X40N]
R28  12K 1% 63mW  [RESC1005X40N]
R29  40.2K 1% 63mW  [RESC1005X40N]
R30  68K 1% 63mW  [RESC1005X40N]
R31  28K 1% 63mW  [RESC1005X40N]
R32  1M 1% 63mW  [RESC1005X40N]
R33  75K 1% 63mW  [RESC1005X40N]
R34  28K 1% 63mW  [RESC1005X40N]
R54  280K 1% 63mW  [RESC1005X40N]
T4  SQ2303ES-T1_GE3  [SOT95P230X110-3N]
T5  BC857BW,135  [SOT65P210X110-3N]
T6  Si2365EDS-T1-GE3  [SOT95P230X110-3N]
U1  LMR14030SDDA  [SOIC127P600X175-9AN-2]
U2  MCP73826  [SOT95P284X122-6N]
U3  TPS63021DSJR  [DSJ14_2P85X1P58]
X2  54-00167  [PJ-002A]  (value not drawn)
X3  1984617  [TERM-BLK-3.5MM]  (value not drawn)

### Blocks framed on the sheet
Power Input Connectors: D1 D3 X2 X3
EMI Filter: C8-C10 D2 F1 L1 L2
Power Supply Status: LED6 LED7 R21 R22
Mounting Holes: MH1-MH4 R23
Battery Charger: C17 C18 CN1 R24 R27 T4 U2
Buck/Boost 3.3V: C22-C27 L4 R32 U3
Power Path: D5 R31 R33 R34 R54 T5 T6
Analog LDO: C20 C21 IC7

### Ports
BAT_CHRGn (in), PGOOD_3.3 (out)

### Nets
3.3V: C21.2 C24.2 C25.2 C26.2 IC7.1(Vin) IC7.3(E) R22.2 R32.2 U3.3(FB) U3.4(VOUT) U3.5(VOUT)
5V: C15.2 C16.2 C17.2 D5.2(A) L3.2 R21.2 R24.2 R27.2 R30.2 T5.2(E) U2.5(V_IN)
CHASSIS_GND: MH1.1(HOLE) MH2.1(HOLE) MH3.1(HOLE) MH4.1(HOLE) R23.1
GND: C8.1 C9.1 C10.1 C14.1 C15.1 C16.1 C17.1 C18.1 C19.1 C20.1 C21.1 C22.1 C23.1 C24.1 C25.1 C26.1 C27.1 CN1.2 D4.A1 D4.A2 IC7.2(GND) L2.1 LED6.1 LED7.1 R23.2 R26.1 R28.2 R29.1 R33.1 R34.1 R54.1 U1.0(PAD) U1.7(GND) U2.2(GND) U3.0(PGND) U3.2(GND) U3.13(SYNC/~{PS})
GND_IN: D2.1(ANODE) L2.2 X2.2(PWR_IN) X3.1(GND_IN)
PWR_IN: D1.1(K) D3.1(K) F1.1
PWR_IN_A: D1.2(A) X2.1(GND_IN)
PWR_IN_B: D3.2(A) X3.2(PWR_IN)
PWR_IN_FILT: C8.2 C9.2 C10.2 C14.2 L1.1 R25.2 U1.2(VIN)
VBATT: C18.2 CN1.1 R31.1 R33.2 T4.3(S) T6.3(S) U2.3(V_BAT)
VDD_ANALOG: C20.2 IC7.5(Vout)
VSYS: C22.2 C23.2 D5.1(K) T6.2(D) U3.10(VIN) U3.11(VIN)
5V_EN: R25.1 R26.2 U1.3(EN)
BAT_CHRGn: R27.1 U2.1(~{SHDN}) ; port BAT_CHRGn
BOOT: C11.1 U1.1(BOOT)
FB: R28.1 R30.1 U1.5(FB)
PGOOD_3.3: R32.1 U3.14(PG) ; port PGOOD_3.3
RT_SYNC: R29.2 U1.4(RT_SYNC)
SS: C19.2 U1.6(SS)
SW: C11.2 D4.K L3.1 U1.8(SW)
V_SNS: R24.1 T4.2(D) U2.6(V_SNS)
NetC27_2: C27.2 U3.1(VINA) U3.12(EN)
NetD2_2: D2.2(CATHODE) F1.2 L1.2
NetL4_1: L4.1 U3.8(L1) U3.9(L1)
NetL4_2: L4.2 U3.6(L2) U3.7(L2)
NetLED6_2: LED6.2 R21.1
NetLED7_2: LED7.2 R22.1
NetR31_2: R31.2 R54.2 T5.1(B)
NetR34_2: R34.2 T5.3(C) T6.1(G)
NetT4_1: T4.1(G) U2.4(V_DRV)

Not connected (* = marked no-connect by the designer): IC7 4(N/C)*; X2 3(PWR_IN)

### Notes on the sheet
- Buck 5V
- 5v/3.5A
- (near C14) C8 C9 C10 as input C
- (in symbol L-Murata-30R@100MHz-5A-0603) 5A

### Library data of the parts
C8-C10 = C-10uF-50V-20%-1210: Capacitor Ceramic X5R 10uF 50V 20% 1210; Type: X7R; FP_DESC: C1210; Tolerance: 20%; Supplier 1: Digi-Key; Supplier Part Number 1: 587-2225-1-ND; Footprint: C1210; MFG: *; MFG_PN: *
C11 C27 = C-100nF-16V-10%-0603: as C28 on sheet 06-ETHERNET; Tolerance: 10%; Type: X7R; Supplier 1: Digi-Key; Supplier Part Number 1: 1276-1001-1-ND; Footprint Checked: -; MFG: *; MFG_PN: *
C14 = C-0.22uF-50V-10%-0805: Capacitor Ceramic X7R 0.22uF 50V 10% 0805; FP_DESC: C0805; Tolerance: 10%; Type: X7R; Supplier 1: Digi-Key; Supplier Part Number 1: 1276-1093-1-ND; MFG_PN: *; MFG: *
C15 C16 = C-47uF-10V-20%-1210: as C38 on sheet 07-USB; Tolerance: 20%; Type: X5R; Supplier 1: Digi-Key; Supplier Part Number 1: 445-6711-1-ND; MFG: *; MFG_PN: *
C17 C18 = C-10uF-10V-20%-1206: Capacitor Tantalum 10uF 10V 20% 1206; FP_DESC: C1206; Tolerance: 20%; Type: Tantalum; Supplier 1: Digi-Key; Supplier Part Number 1: 478-1657-1-ND; MFG: *; MFG_PN: *
C19 = C-27nF-50V-10%-0603: Capacitor Ceramic X7R 27nF 50V 10% 0603; FP_DESC: C0603; Tolerance: 10%; Type: X7R; Supplier 1: Digi-Key; Supplier Part Number 1: 1276-2025-1-ND; MFG: *; MFG_PN: *
C20 C21 = C-2.2uF-6.3V-20%-0603: Capacitor Ceramic X5R 2.2uF 6.3V 20% 0603; FP_DESC: C0603; Tolerance: 20%; Supplier 1: Digi-Key; Supplier Part Number 1: 311-1814-1-ND; Type: X5R; MFG: *; MFG_PN: *
C22 C23 = C-10uF-6.3V-20%-0603: Capacitor Ceramic X5R 10uF 6.3V 20% 0603; Type: X7R; FP_DESC: C0603; Tolerance: 20%; Supplier 1: Digi-Key; Supplier Part Number 1: 490-3896-1-ND; MFG: *; MFG_PN: *
C24-C26 = C-22uF-6.3V-20%-0603: Capacitor Ceramic X5R 22uF 6.3V 20% 0603; FP_DESC: C0603; Tolerance: 20%; Type: X5R; Supplier 1: Digi-Key; Supplier Part Number 1: 445-8028-1-ND; MFG: *; MFG_PN: *
CN1 = CON-JST-B2B-PH-K-S(LF)(SN): Connector Header Through Hole 2 position 0.079" (2.00mm); MFG: JST; FP_DESC: Header, Male pins, 1x2, 2mm, Vertical; Symbol Checked: Ok; MFG_PN: B2B-PH-K-S(LF)(SN); Footprint Checked: Assign OK, Footprint OK; Supplier 1: Digi-Key; Supplier Part Number 1: 455-1704-ND
D1 D3 D5 = D-NXP- PMEG4050ETP,115: Diode Schottky 40V 5A Surface Mount CFP5; MFG: Nexperia USA Inc.; Supplier 1: Digi-Key; Supplier Part Number 1: 1727-1732-1-ND; MFG_PN: PMEG4050ETP,115; Footprint Checked: -; Symbol Checked: -
D2 = D-Vishay-SMAJ36CA: 58.1V Clamp 6.9A Ipp Tvs Diode Surface Mount DO-214AC (SMA); MFG: Vishay; Symbol Checked: Ok; FP_DESC: SMA; MFG_PN: SMAJ36CA; Footprint Checked: Assign OK, Footprint OK; Supplier 1: Digi-Key; Supplier Part Number 1: SMAJ36CALFCT-ND
D4 = D-Vishay-SS5P5-M3/87A: Diode Schottky, SS5P5-M3/87A, 50V(Vrrm), 5A(If); MFG: Vishay; MFG_PN: SS8P6C-M3/86A; Supplier 1: Digi-Key; Supplier Part Number 1: SS5P5-M3/87AGICT-ND; Footprint Checked: -; Symbol Checked: -
F1 = F-BEL-3A-63V: 3A 63V AC 63V DC Fuse Board Mount (Cartridge Style Excluded) Surface Mount 1206 (3216 Metric); FP_DESC: R1206; MFG: BEL; POWER: 250mW; MFG_PN: 0685T3000-01; Footprint Checked: -; VALUE: 3A; Symbol Checked: -; Supplier 1: Digi-Key; Supplier Part Number 1: 507-1896-1-ND
IC7 = IC-ON-NCP511SN33T1G: NCP511SN33T1G LDO Regulator; MFG: ON Semiconductor; Supplier 1: Digi-Key; Supplier Part Number 1: NCP511SN33T1GOSCT-ND; Footprint Checked: -; Symbol Checked: -; MFG_PN: NCP511SN33T1G
L1 L2 = L-Murata-30R@100MHz-5A-0603: as L9 on sheet 07-USB; Supplier 1: Digi-Key; Supplier Part Number 1: 490-5447-1-ND; Footprint Checked: Ok, Assign Ok; Symbol Checked: -
L3 = L-Bourns-SRR1280-150M: FIXED IND 15UH 5.2A 28.5MOHM SMD; MFG: Bourns Inc.; FP_DESC: Non Standard; Footprint Checked: -; Symbol Checked: -; Value: 15uH; Supplier 1: Digi-Key; Supplier Part Number 1: SRR1280-150MCT-ND; MFG_PN: SRR1280-150M
L4 = L-1.5uH-4.2A-30%: Inductor Ferrite core 1.5uH 4.2A 30%; MFG: TAIYO YUDEN; FP_DESC: L1008; MFG_PN: NRS6028T1R5NMGJ; Footprint Checked: -; Symbol Checked: -; Value: 1.5uH; Supplier 1: Digi-Key; Supplier Part Number 1: 587-2937-1-ND
LED6 LED7 = LED-GREEN-0603: Green 520nm LED Indication - Discrete 3.2V 0603 (1608 Metric); MFG: Würth Elektronik; MFG_PN: 150060GS75000; Color: Green; Supplier 1: Digi-Key; Supplier Part Number 1: 732-4971-1-ND; Footprint Checked: -; Symbol Checked: -
MH1-MH4 = MECH-MountingHoles: PCB Mounting Holes, hole diemeter = 3.2mm, pad diameter = 6.2mm; Footprint Checked: -; Symbol Checked: -
R21 = R-120R-1%-0402: Resistor 120ohm 63mW 1% 0402; MFG: <GENERIC>; Power: 63mW; Tolerance: 1%; Footprint: R0402; Value: 120R; Supplier 1: Digi-Key; Supplier Part Number 1: 541-120LCT-ND; Footprint Checked: -; Symbol Checked: -; MFG_PN: <GENERIC>
R22 = R-6.8R-1%-0402: Resistor 6.8ohm 63mW 1% 0402; Manufacturer: <GENERIC>; Replacement Allowed: Yes; Power: 63mW; Tolerance: 1%; Footprint: R0402; Value: 6.8R; Supplier 1: Digi-Key; Supplier Part Number 1: 541-68.0LCT-ND; Manufacturer Part Number: <GENERIC>
R23 = R-0R-0402: as R42 on sheet 06-ETHERNET; Power: ?; Value: 0R; Footprint: R0402; Supplier 1: Digi-Key; Supplier Part Number 1: 541-2952-1-ND; Footprint Checked: -; MFG_PN: <GENERIC>; Symbol Checked: -
R24 = R-0.1-1%-0603: Resistor 0.1ohm 1/3W 1% 0603; Power: 1/3; MFG: <GENERIC>; Tolerance: 1%; Value: 0.1R; Footprint: R0603; Supplier 1: Digi-Key; Supplier Part Number 1: P17478CT-ND; Footprint Checked: -; Symbol Checked: -; MFG_PN: <GENERIC>
R25 = R-137K-1%-0402: Resistor 137Kohm 63mW 1% 0402; Symbol Checked: T; MFG: <GENERIC>; Power: 63mW; Tolerance: 1%; Footprint: R0402; Value: 137k; Supplier 1: Digi-Key; Supplier Part Number 1: 541-137KLCT-ND; Footprint Checked: -; MFG_PN: <GENERIC>
R26 R31 R34 = R-28K-1%-0402: Resistor 28Kohm 63mW 1% 0402; Symbol Checked: T; MFG: <GENERIC>; Power: 63mW; Tolerance: 1%; Footprint: R0402; Value: 28k; Supplier 1: Digi-Key; Supplier Part Number 1: 541-4852-1-ND; Footprint Checked: -; MFG_PN: <GENERIC>
R27 = R-100K-1%-0402: as R49 on sheet 07-USB; Power: 63mW; Tolerance: 1%; Value: 100k; Footprint: R0402; Supplier 1: Digi-Key; Supplier Part Number 1: 541-100KLCT-ND; Manufacturer Part Number: <GENERIC>
R28 = R-12K-1%-0402: Resistor 12Kohm 63mW 1% 0402; Symbol Checked: T; MFG: <GENERIC>; Power: 63mW; Tolerance: 1%; Footprint: R0402; Value: 12K; Supplier 1: Digi-Key; Supplier Part Number 1: 541-4063-1-ND; Footprint Checked: -; MFG_PN: <GENERIC>
R29 = R-40.2K-1%-0402: Resistor 40.2Kohm 63mW 1% 0402; Symbol Checked: T; MFG: <GENERIC>; Power: 63mW; Tolerance: 1%; Footprint: R0402; Value: 40.2k; Supplier 1: Digi-Key; Supplier Part Number 1: 541-40.2KLCT-ND; Footprint Checked: -; MFG_PN: <GENERIC>
R30 = R-68K-1%-0402_1: Resistor 68Kohm 63mW 1% 0402; Symbol Checked: T; MFG: <GENERIC>; Power: 63mW; Tolerance: 1%; Footprint: R0402; Value: 68K; Supplier 1: Digi-Key; Supplier Part Number 1: 541-68.0KLCT-ND; Footprint Checked: -; MFG_PN: <GENERIC>
R32 = R-1M-1%-0402: Resistor 1Mohm 63mW 1% 0402; Manufacturer: <GENERIC>; Replacement Allowed: Yes; Power: 63mW; Tolerance: 1%; Footprint: R0402; Value: 1M; Supplier 1: Digi-Key; Supplier Part Number 1: 541-1.00MLCT-ND; Manufacturer Part Number: <GENERIC>
R33 = R-75K-1%-0402: Resistor 75Kohm 63mW 1% 0402; MFG: <GENERIC>; Power: 63mW; Tolerance: 1%; Footprint: R0402; Value: 75k; Supplier 1: Digi-Key; Supplier Part Number 1: 541-75.0KLCT-ND; Footprint Checked: -; Symbol Checked: -; MFG_PN: <GENERIC>
R54 = R-280K-1%-0402: Resistor 280Kohm 63mW 1% 0402; MFG: <GENERIC>; Power: 63mW; Tolerance: 1%; Footprint: R0402; Value: 280k; Supplier 1: Digi-Key; Supplier Part Number 1: 541-280KLCT-ND; Footprint Checked: -; Symbol Checked: -; MFG_PN: <GENERIC>
T4 = T-Vishay-SQ2303ES: P-Channel 30V 2.5A (Tc) 1.9W (Tc) Surface Mount TO-236 (SOT-23); MFG: VISHAY; FP_DESC: SOT23-3; MFG_PN: SQ2303ES-T1_GE3; Footprint Checked: -; Symbol Checked: -; Supplier 1: Digi-Key; Supplier Part Number 1: SQ2303ES-T1_GE3CT-ND
T5 = T-NXP-BC857BW: PNP Transistor NXP BC857BW,135; FP_DESC: SOT323; MFG: NXP; MFG_PN: BC857BW,135; Footprint Checked: -; Symbol Checked: -; Supplier 1: Digi-Key; Supplier Part Number 1: 1727-1882-1-ND
T6 = T-Vishay-Si2365EDS: MOSFET, P channel Vishay Si2365EDS-T1-GE3; FP_DESC: SOT23-3; MFG: VISHAY; MFG_PN: Si2365EDS-T1-GE3; Footprint Checked: -; Symbol Checked: -; Supplier 1: Digi-Key; Supplier Part Number 1: SI2365EDS-T1-GE3CT-ND
U1 = IC-TI-LMR14030: Buck Switching Regulator IC Positive Adjustable 0.8V 1 Output 3.5A 8-PowerSOIC (0.154", 3.90mm Width); Symbol Checked: DMT; MFG: Texas Instruments; Type: DEV; Value: Value; Supplier 1: Digi-Key; Supplier Part Number 1: 296-44321-1-ND; Footprint Checked: -
U2 = IC-Microchip-MCP73826: Charger IC Lithium Ion SOT-23-6; Symbol Checked: D; MFG_PN: MCP73826-4.1VCHTR; Footprint Checked: -; MFG: Microchip; Supplier 1: Digi-Key; Supplier Part Number 1: MCP73826-4.1VCHCT-ND
U3 = IC-TI-TPS63021: Buck-Boost Switching Regulator IC Positive Fixed 3.3V 1 Output 3.5A (Switch) 14-VFDFN Exposed Pad; MFG: Texas Instruments; Type: DEV; Value: Value; Supplier 1: Digi-Key; Supplier Part Number 1: 296-27259-1-ND; Footprint Checked: D; Symbol Checked: -; Parameter 1: *
X2 = CON-Tensility-54-00167: Power Barrel Connector Jack 2.50mm ID (0.098"), 5.50mm OD (0.217") Through Hole, Right Angle; MFG: Tensility International Corp; Supplier 1: Digi-Key; Supplier Part Number 1: 839-54-00167-ND; Footprint Checked: -; MFG_PN: 54-00167; Symbol Checked: -
X3 = CON-Phoenix-1984617-1x2-3.5mm: 2 Position Wire to Board Terminal Block Horizontal with Board 0.138" (3.50mm) Through Hole; No. of ways: 1x2; Pitch: 3.5mm; MFG: Phoenix Contact; Supplier 1: Digi-Key; Supplier Part Number 1: 277-1721-ND; Footprint Checked: -; MFG_PN: 1984617; Symbol Checked: -

## Sheet 08-THREAD.SchDoc
size A4
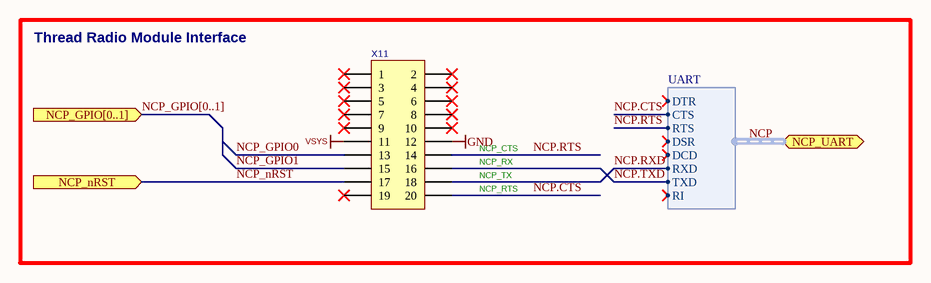
[diagram p4: 08-THREAD.SchDoc]

### Parts
X11  PH2-20-UA  [T_JVE_21B22564-40S10B-01G - ThreadModule]  (value not drawn)

### Blocks framed on the sheet
Thread Radio Module Interface: X11

### Ports
NCP_GPIO[0..1] (in), NCP_nRST (in), NCP_UART (bidir, harness UART)

### Harnesses
UART: RTS, DSR, DCD, RXD, TXD, CTS, DTR, RI

### Nets
GND: X11.12
VSYS: X11.11
NCP.CTS: X11.20 ; port NCP_UART.CTS
NCP.RTS: X11.14 ; port NCP_UART.RTS
NCP.RXD: X11.18 ; port NCP_UART.RXD
NCP.TXD: X11.16 ; port NCP_UART.TXD
NCP_GPIO0: X11.13
NCP_GPIO1: X11.15
NCP_nRST: X11.17 ; port NCP_nRST

Not connected (* = marked no-connect by the designer): X11 1* 2* 3* 4* 5* 6* 7* 8* 9* 10* 19*

### Buses and harness runs
bus NCP_GPIO[0..1] = port NCP_GPIO[0..1]
harness NCP = port NCP_UART

### Notes on the sheet
- NCP_RX
- NCP_CTS
- NCP_TX
- NCP_RTS

### Library data of the parts
X11 = CON-Adam-PH2-20-UA-2X10-2.54mm_ThreadModule: Connector Header Through Hole 20 position 0.100" (2.54mm); No. of ways: 2X20; MFG: FCI; MFG_PN: 68691-420HLF; Supplier 1: Digi-Key; Supplier Part Number 1: 2057-PH2-20-UA-ND; System: Connector; Footprint Checked: -; Symbol Checked: -

## Sheet 09-WIFI.SchDoc
size A4
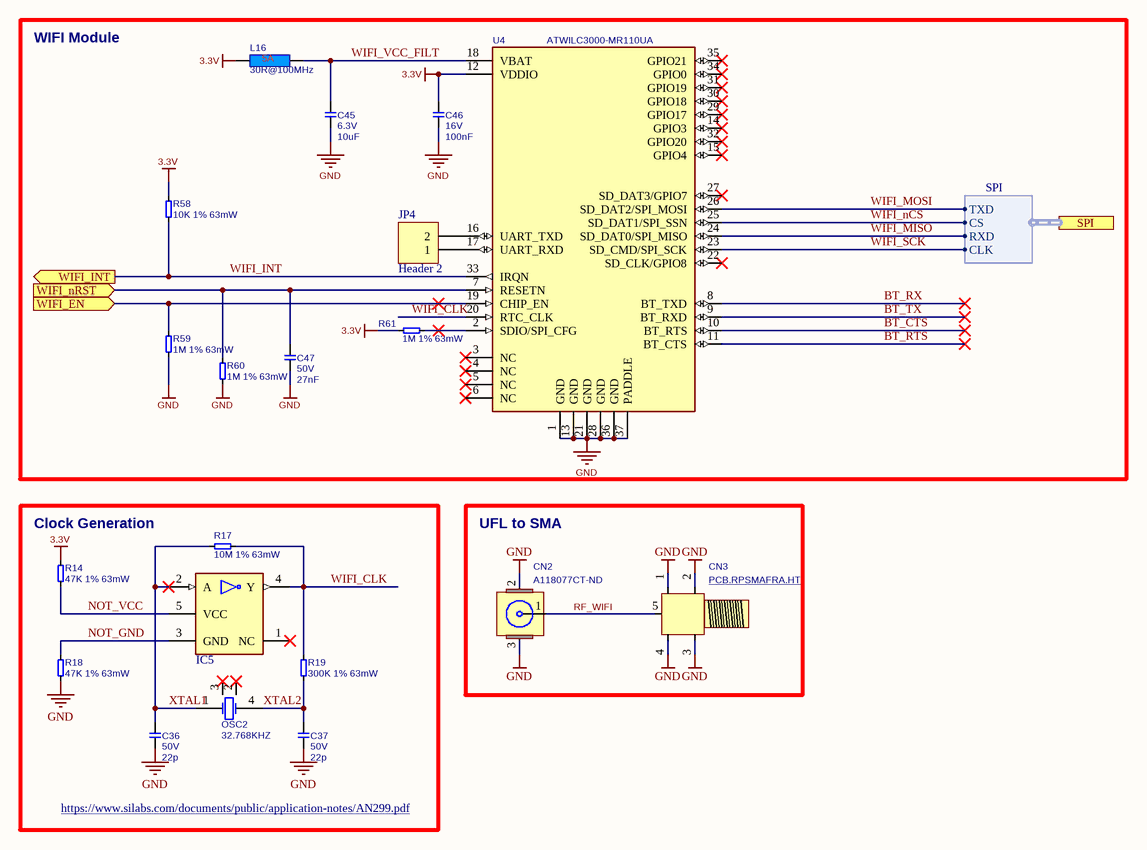
[diagram p5: 09-WIFI.SchDoc]

### Parts
C36  value 22p  Rating: 50V  [T_CAPC0603X33N]  (hidden comment: 22pF 50V 10% C0G)
C37  value 22p  Rating: 50V  [T_CAPC0603X33N]  (hidden comment: 22pF 50V 10% C0G)
C45  value 10uF  Rating: 6.3V  [T_CAPC0603X33N]  (hidden comment: 10uF 6.3V 20% X5R)
C46  value 100nF  Rating: 16V  [CAPC1005X60N]  (hidden comment: 100nF 16V 10% X7R)
C47  value 27nF  Rating: 50V  [T_CAPC0603X33N]  (hidden comment: 27nF 50V 20% X7R)
CN2  A118077CT-ND  [U.FL-R-SMT-1]
CN3  PCB.RPSMAFRA.HT  [0733910320]
IC5  SN74LVC1G04  [SOT65P210X110-5N]  (value not drawn)
JP4  Header 2  [HDR1X2]
L16  value 30R@100MHz  [INDC1608X95N]  (hidden comment: BLM18KG300TN1D)
OSC2  value 32.768KHZ  [OSC_ABRACON_ABS25]  (hidden comment: CRYSTAL 32.7680KHZ 12.5PF SMD)
R14  47K 1% 63mW  [RESC1005X40N]
R17  10M 1% 63mW  [RESC1005X40N]
R18  47K 1% 63mW  [RESC1005X40N]
R19  300K 1% 63mW  [RESC1005X40N]
R58  10K 1% 63mW  [RESC1005X40N]
R59  1M 1% 63mW  [RESC1005X40N]
R60  1M 1% 63mW  [RESC1005X40N]
R61  1M 1% 63mW  [RESC1005X40N]
U4  ATWILC3000-MR110UA  [ATWILC3000-MR110CA]

### Blocks framed on the sheet
WIFI Module: C45-C47 JP4 L16 R58-R61 U4
Clock Generation: C36 C37 IC5 OSC2 R14 R17-R19
UFL to SMA: CN2 CN3

### Ports
SPI (harness SPI), WIFI_EN (in), WIFI_INT (out), WIFI_nRST (in)

### Harnesses
SPI: CS, CLK, RXD, TXD

### Nets
3.3V: C46.2 L16.2 R14.2 R58.2 R61.1 U4.12(VDDIO)
GND: C36.1 C37.1 C45.1 C46.1 C47.1 CN2.2(GND) CN2.3(GND) CN3.1(GND) CN3.2(GND) CN3.3(GND) CN3.4(GND) R18.1 R59.1 R60.1 U4.1(GND) U4.13(GND) U4.21(GND) U4.28(GND) U4.36(GND) U4.37(PADDLE)
BT_CTS: U4.10(BT_RTS)
BT_RTS: U4.11(BT_CTS)
BT_RX: U4.8(BT_TXD)
BT_TX: U4.9(BT_RXD)
NOT_GND: IC5.3(GND) R18.2
NOT_VCC: IC5.5(VCC) R14.1
RESET_OUTn: C47.2 R60.2 U4.7(RESETN) ; port WIFI_nRST
RF_WIFI: CN2.1(SIG) CN3.5(SIG)
WIFI_CLK: IC5.4(Y) R17.1 R19.2 U4.20(RTC_CLK)
WIFI_EN: R59.2 U4.19(CHIP_EN) ; port WIFI_EN
WIFI_INT: R58.1 U4.33(IRQN) ; port WIFI_INT
WIFI_MISO: U4.24(SD_DAT0/SPI_MISO) ; port SPI.RXD  [project net SPI.RXD]
WIFI_MOSI: U4.26(SD_DAT2/SPI_MOSI) ; port SPI.TXD  [project net SPI.TXD]
WIFI_nCS: U4.25(SD_DAT1/SPI_SSN) ; port SPI.CS  [project net SPI.CS]
WIFI_SCK: U4.23(SD_CMD/SPI_SCK) ; port SPI.CLK  [project net SPI.CLK]
WIFI_VCC_FILT: C45.2 L16.1 U4.18(VBAT)
XTAL1: C36.2 IC5.2(A) OSC2.1(OSC1) R17.2
XTAL2: C37.2 OSC2.4(OSC4) R19.1
NetJP4_1: JP4.1 U4.17(UART_RXD)
NetJP4_2: JP4.2 U4.16(UART_TXD)
NetR61_2: R61.2 U4.2(SDIO/SPI_CFG)

Not connected (* = marked no-connect by the designer): IC5 1(NC)*; OSC2 2* 3*; U4 3(NC)* 4(NC)* 5(NC)* 6(NC)* 14(GPIO3)* 15(GPIO4)* 22(SD_CLK/GPIO8)* 27(SD_DAT3/GPIO7)* 29(GPIO17)* 30(GPIO18)* 31(GPIO19)* 32(GPIO20)* 34(GPIO0)* 35(GPIO21)*

### Notes on the sheet
- https://www.silabs.com/documents/public/application-notes/AN299.pdf
- (in symbol L-Murata-30R@100MHz-5A-0603) 5A

### Library data of the parts
C36 C37 = C-22pF-50V-10%-0603: Capacitor Ceramic C0G 22pF 50V 10% 0603; FP_DESC: C0603; Tolerance: 10%; Type: C0G; Supplier 1: Digi-Key; Supplier Part Number 1: 478-7914-1-ND; MFG: *; MFG_PN: *
C45 = C-10uF-6.3V-20%-0603: as C22 on sheet 02-POWER SUPPLY; Tolerance: 20%; Supplier 1: Digi-Key; Supplier Part Number 1: 490-3896-1-ND; MFG: *; MFG_PN: *
C46 = C-100nF-16V-10%-0603: as C28 on sheet 06-ETHERNET; Tolerance: 10%; Type: X7R; Supplier 1: Digi-Key; Supplier Part Number 1: 1276-1001-1-ND; Footprint Checked: -; MFG: *; MFG_PN: *
C47 = C-27nF-50V-10%-0603: as C19 on sheet 02-POWER SUPPLY; Tolerance: 10%; Type: X7R; Supplier 1: Digi-Key; Supplier Part Number 1: 1276-2025-1-ND; MFG: *; MFG_PN: *
CN2 = CON-TE-A118077CT-ND: U.FL (UMCC) Connector Jack, Male Pin 50Ohm Surface Mount Solder; MFG: TE Connectivity AMP Connectors; FP_DESC: U.FL connector; Symbol Checked: Ok; MFG_PN: A118077CT-ND; Footprint Checked: Assign OK, Footprint OK; Supplier 1: Digi-Key; Supplier Part Number 1: A118077DKR-ND
CN3 = CON-Taoglas-PCB.RPSMAFRA.HT: RP-SMA Conector Jack, clavija macho 50Ohm Orificio pasante, ángulo recto Soldadura; FP_DESC: SMA, Right angle; MFG: Taoglas Limited; Symbol Checked: Ok; MFG_PN: PCB.SMAFRA.HT; Footprint Checked: Assign OK, Footprint OK; Supplier 1: Digi-Key; Supplier Part Number 1: 931-1360-ND
IC5 = IC-TI-SN74LVC1G04: IC INVERTER 1CH 1-INP SC70-5; MFG: Texas Instruments; Supplier 1: Digi-Key; Supplier Part Number 1: 296-11600-1-ND; Footprint Checked: -; MFG_PN: SN74LVC1G04; Symbol Checked: -
JP4 = Header 2: Header, 2-Pin; LatestRevisionDate: 17-Jul-2002; LatestRevisionNote: Re-released for DXP Platform.; Publisher: Altium Limited
L16 = L-Murata-30R@100MHz-5A-0603: as L9 on sheet 07-USB; Supplier 1: Digi-Key; Supplier Part Number 1: 490-5447-1-ND; Footprint Checked: Ok, Assign Ok; Symbol Checked: -
OSC2 = OSC-ABS25-32.768KHZ-T: 32.768kHz ±20ppm Cristal 12.5pF  4-SOJ, 5.50mm step; MFG: ABRACON; Tolerance: 20ppm; Supplier 1: Digi-Key; Supplier Part Number 1: 535-9166-1-ND; Footprint Checked: -; MFG_PN: ABS25-32.768KHZ-T; Symbol Checked: -
R14 R18 = R-47K-1%-0402: Resistor 47Kohm 63mW 1% 0402; MFG: <GENERIC>; Power: 63mW; Tolerance: 1%; Footprint: R0402; Value: 47K; Supplier 1: Digi-Key; Supplier Part Number 1: 541-47.0KLCT-ND; Footprint Checked: -; MFG_PN: <GENERIC>; Symbol Checked: -
R17 = R-10M-1%-0402: Resistor 10Mohm 63mW 1% 0402; MFG: <GENERIC>; Power: 63mW; Tolerance: 1%; Footprint: R0402; Value: 10M; Supplier 1: Digi-Key; Supplier Part Number 1: 541-10.0MLCT-ND; Footprint Checked: -; MFG_PN: <GENERIC>; Symbol Checked: -
R19 = R-300K-1%-0402: Resistor 300Kohm 63mW 1% 0402; MFG: <GENERIC>; Power: 63mW; Tolerance: 1%; Footprint: R0402; Value: 300K; Supplier 1: Digi-Key; Supplier Part Number 1: 541-4882-1-ND; Footprint Checked: -; MFG_PN: <GENERIC>; Symbol Checked: -
R58 = R-10K-1%-0402: as R20 on sheet 07-USB; Power: 63mW; Tolerance: 1%; Value: 10k; Footprint: R0402; Supplier 1: Digi-Key; Supplier Part Number 1: 541-10.0KLDKR-ND; Footprint Checked: -; Symbol Checked: -; MFG_PN: <GENERIC>
R59-R61 = R-1M-1%-0402: as R32 on sheet 02-POWER SUPPLY; Power: 63mW; Tolerance: 1%; Value: 1M; Footprint: R0402; Supplier 1: Digi-Key; Supplier Part Number 1: 541-1.00MLCT-ND; Manufacturer Part Number: <GENERIC>
U4 = IC-Microchip-ATWILC3000: BlueTooth, WiFi 802.11b/g/n, BlueTooth v4.0 Módulos de transceptor RF 2.4GHz Antena no incluida, U.FL Montaje en superficie; FP_DESC: ATWILC3000-MR110CA Module; Symbol Checked: M; Footprint Checked: -; MFG: MICROCHIP; MFG_PN: ATWILC3000-MR110UA; Supplier 1: Digi-Key; Supplier Part Number 1: ATWILC3000-MR110UA-ND

## Sheet 10-MODEM.SchDoc
size A4
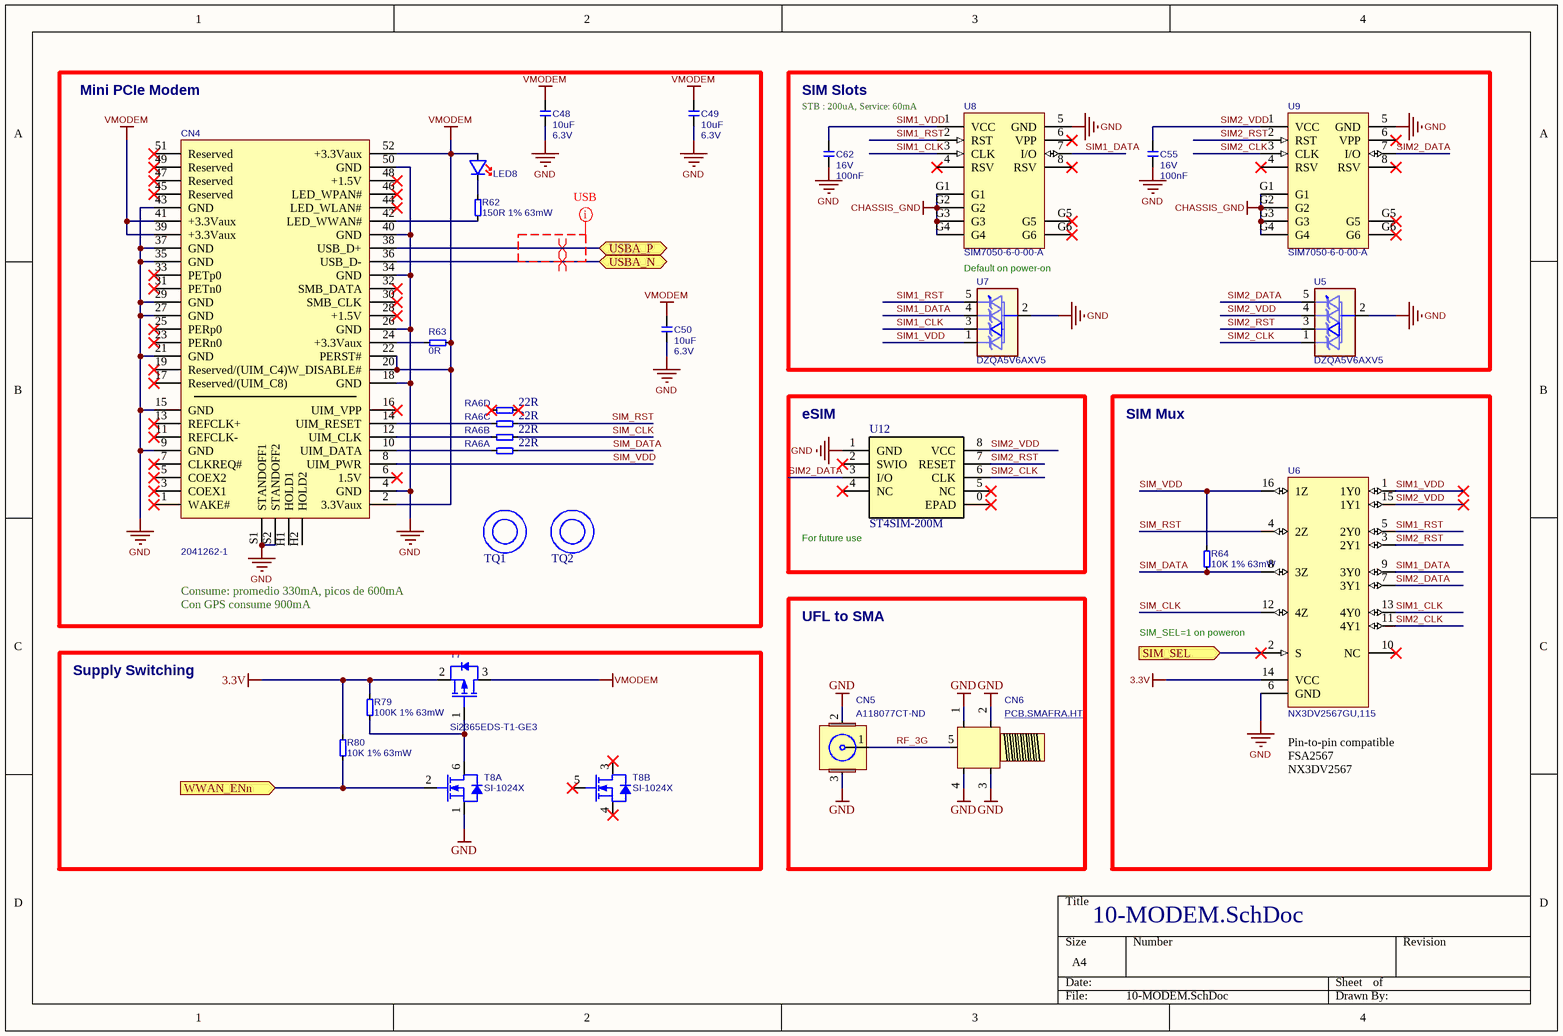
[diagram p6: 10-MODEM.SchDoc]

### Parts
C48  value 10uF  Rating: 6.3V  [T_CAPC0603X33N]  (hidden comment: 10uF 6.3V 20% X5R)
C49  value 10uF  Rating: 6.3V  [T_CAPC0603X33N]  (hidden comment: 10uF 6.3V 20% X5R)
C50  value 10uF  Rating: 6.3V  [T_CAPC0603X33N]  (hidden comment: 10uF 6.3V 20% X5R)
C55  value 100nF  Rating: 16V  [CAPC1005X60N]  (hidden comment: 100nF 16V 10% X7R)
C62  value 100nF  Rating: 16V  [CAPC1005X60N]  (hidden comment: 100nF 16V 10% X7R)
CN4  2041262-1  [2041262-1]
CN5  A118077CT-ND  [U.FL-R-SMT-1]
CN6  PCB.SMAFRA.HT  [0733910320]
LED8  150060RS75000  [LEDC1608X80N]  (value not drawn)
R62  150R 1% 63mW  [RESC1005X40N]
R63  0R  [RESC1005X40N]
R64  10K 1% 63mW  [RESC1005X40N]
R79  100K 1% 63mW  [RESC1005X40N]
R80  10K 1% 63mW  [RESC1005X40N]
RA6  22R  [T_Resistor_Array_X4]  (parts A,B,C,D of 4)
T7  Si2365EDS-T1-GE3  [SOT95P230X110-3N]
T8  SI-1024X  [SOTFL50P160X60-6N]  (parts A,B of 2)
TQ1  9774040243R  (value not drawn)  (mechanical)
TQ2  9774040243R  (value not drawn)  (mechanical)
U5  DZQA5V6AXV5  [SOTFL50P162X62-5N]
U6  NX3DV2567GU,115  [XFQFN-16]
U7  DZQA5V6AXV5  [SOTFL50P162X62-5N]
U8  SIM7050-6-0-00-A  [SIM7050-8-0-00-X_revC]
U9  SIM7050-6-0-00-A  [SIM7050-8-0-00-X_revC]
U12  ST4SIM-200M  [ST4SIM-200M]

### Blocks framed on the sheet
Mini PCIe Modem: C48-C50 CN4 LED8 R62 R63 RA6 TQ1 TQ2
SIM Slots: C55 C62 U5 U7-U9
eSIM: U12
SIM Mux: R64 U6
UFL to SMA: CN5 CN6
Supply Switching: R79 R80 T7 T8

### Ports
SIM_SEL (in), USBA_N (bidir), USBA_P (bidir), WWAN_ENn (in)

### Nets
3.3V: R79.2 R80.2 T7.2(D) U6.14(VCC)
CHASSIS_GND: U8.G1 U8.G2 U8.G3 U8.G4 U9.G1 U9.G2 U9.G3 U9.G4
GND: C48.2 C49.2 C50.2 C55.2 C62.2 CN4.4(GND) CN4.9(GND) CN4.15(GND) CN4.18(GND) CN4.21(GND) CN4.26(GND) CN4.27(GND) CN4.29(GND) CN4.34(GND) CN4.35(GND) CN4.37(GND) CN4.40(GND) CN4.43(GND) CN4.50(GND) CN4.S1(STANDOFF1) CN4.S2(STANDOFF2) CN5.2(GND) CN5.3(GND) CN6.1(GND) CN6.2(GND) CN6.3(GND) CN6.4(GND) T8.1(S) U5.2 U6.6(GND) U7.2 U8.5(GND) U9.5(GND) U12.1(GND)
VMODEM: C48.1 C49.1 C50.1 CN4.2(3.3Vaux) CN4.20(W_DISABLE#) CN4.22(PERST#) CN4.39(+3.3Vaux) CN4.41(+3.3Vaux) CN4.52(+3.3Vaux) LED8.2 R63.1 T7.3(S)
RF_3G: CN5.1(SIG) CN6.5(SIG)
SIM1_CLK: U6.13(4Y0) U7.3 U8.3(CLK)
SIM1_DATA: U6.9(3Y0) U7.4 U8.7(I/O)
SIM1_RST: U6.5(2Y0) U7.5 U8.2(RST)
SIM1_VDD: C62.1 U6.1(1Y0) U7.1 U8.1(VCC)
SIM2_CLK: U5.1 U6.11(4Y1) U9.3(CLK) U12.6(CLK)
SIM2_DATA: U5.5 U6.7(3Y1) U9.7(I/O) U12.3(I/O)
SIM2_RST: U5.3 U6.3(2Y1) U9.2(RST) U12.7(RESET)
SIM2_VDD: C55.1 U5.4 U6.15(1Y1) U9.1(VCC) U12.8(VCC)
SIM_CLK: RA6.6 U6.12(4Z)
SIM_DATA: R64.1 RA6.5 U6.8(3Z)
SIM_RST: RA6.7 U6.4(2Z)
SIM_SEL: U6.2(S) ; port SIM_SEL
SIM_VDD: CN4.8(UIM_PWR) R64.2 U6.16(1Z)
USBA_N: CN4.36(USB_D-) ; port USBA_N
USBA_P: CN4.38(USB_D+) ; port USBA_P
WWAN_ENn: R80.1 T8.2(G) ; port WWAN_ENn
NetCN4_10: CN4.10(UIM_DATA) RA6.1
NetCN4_12: CN4.12(UIM_CLK) RA6.2
NetCN4_14: CN4.14(UIM_RESET) RA6.3
NetCN4_24: CN4.24(+3.3Vaux) R63.2
NetCN4_42: CN4.42(LED_WWAN#) R62.2
NetLED8_1: LED8.1 R62.1
NetR79_1: R79.1 T7.1(G) T8.6(D)

Not connected (* = marked no-connect by the designer): CN4 1(WAKE#)* 3(COEX1)* 5(COEX2)* 6(1.5V)* 7(CLKREQ#)* 11(REFCLK-)* 13(REFCLK+)* 16(UIM_VPP)* 17(Reserved/(UIM_C8))* 19(Reserved/(UIM_C4))* 23(PERn0)* 25(PERp0)* 28(+1.5V)* 30(SMB_CLK)* 31(PETn0)* 32(SMB_DATA)* 33(PETp0)* 44(LED_WLAN#)* 45(Reserved)* 46(LED_WPAN#)* 47(Reserved)* 48(+1.5V)* 49(Reserved)* 51(Reserved)* H1(HOLD1) H2(HOLD2); RA6 4* 8*; T8 3(D)* 4(S)* 5(G)*; U6 10(NC)*; U8 4(RSV)* 6(VPP)* 8(RSV)* G5* G6*; U9 4(RSV)* 6(VPP)* 8(RSV)* G5* G6*; U12 0(EPAD)* 2(SWIO)* 4(NC)* 5(NC)*

### Layout directives
net class USB: (no net found under the mark)
differential pair: USBA_N, USBA_P

### Notes on the sheet
- STB : 200uA, Service: 60mA
- Default on power-on
- (near U12) For future use
- Consume: promedio 330mA, picos de 600mA
- Con GPS consume 900mA
- SIM_SEL=1 on poweron
- (near U6) Pin-to-pin compatible
  FSA2567
  NX3DV2567

### Library data of the parts
C48-C50 = C-10uF-6.3V-20%-0603: as C22 on sheet 02-POWER SUPPLY; Tolerance: 20%; Supplier 1: Digi-Key; Supplier Part Number 1: 490-3896-1-ND; MFG: *; MFG_PN: *
C55 C62 = C-100nF-16V-10%-0603: as C28 on sheet 06-ETHERNET; Tolerance: 10%; Type: X7R; Supplier 1: Digi-Key; Supplier Part Number 1: 1276-1001-1-ND; Footprint Checked: -; MFG: *; MFG_PN: *
CN4 = CON-TE-2041262-1: 52 Position Female Connector PCI Express Mini Card Gold 0.031" (0.80mm) Black; FP_DESC: miniPCIe; MFG: TE; Symbol Checked: Ok; MFG_PN: 2041262-1; Footprint Checked: Assign OK, Footprint OK; Supplier 1: Digi-Key; Supplier Part Number 1: A125147CT-ND
CN5 = CON-TE-A118077CT-ND: as CN2 on sheet 09-WIFI; MFG_PN: A118077CT-ND; Footprint Checked: Assign OK, Footprint OK; Supplier 1: Digi-Key; Supplier Part Number 1: A118077DKR-ND
CN6 = CON-Taoglas-PCB.SMAFRA.HT: SMA Connector Jack, Female Socket 50Ohm Through Hole, Right Angle Solder; FP_DESC: SMA, Right angle; MFG: Taoglas Limited; Symbol Checked: Ok; Footprint Checked: Assign OK, Footprint OK; Supplier 1: Digi-Key; Supplier Part Number 1: 931-1361-ND; MFG_PN: PCB.SMAFRA.HT
LED8 = LED-RED-0603: Red 625nm LED Indication - Discrete 2V 0603 (1608 Metric); MFG: Würth Elektronik; MFG_PN: 150060RS75000; Color: Red; Supplier 1: Digi-Key; Supplier Part Number 1: 732-4978-1-ND; Footprint Checked: -; Symbol Checked: -
R62 = R-150R-1%-0402: as R47 on sheet 06-ETHERNET; Power: 63mW; Tolerance: 1%; Value: 150R; Footprint: R0402; Supplier 1: Digi-Key; Supplier Part Number 1: 541-CRCW0402150RFKTDCT-ND; Footprint Checked: -; Symbol Checked: -; MFG_PN: <GENERIC>
R63 = R-0R-0402: as R42 on sheet 06-ETHERNET; Power: ?; Value: 0R; Footprint: R0402; Supplier 1: Digi-Key; Supplier Part Number 1: 541-2952-1-ND; Footprint Checked: -; Symbol Checked: -; MFG_PN: <GENERIC>
R64 R80 = R-10K-1%-0402: as R20 on sheet 07-USB; Power: 63mW; Tolerance: 1%; Value: 10k; Footprint: R0402; Supplier 1: Digi-Key; Supplier Part Number 1: 541-10.0KLDKR-ND; Footprint Checked: -; Symbol Checked: -; MFG_PN: <GENERIC>
R79 = R-100K-1%-0402: as R49 on sheet 07-USB; Power: 63mW; Tolerance: 1%; Value: 100k; Footprint: R0402; Supplier 1: Digi-Key; Supplier Part Number 1: 541-100KLCT-ND; Manufacturer Part Number: <GENERIC>
RA6 = RA-22R-5%-1206-div: Resistor Array 22 R 63mW 5% 1206; MFG: Generic; Tolerance: 5%; Power Dissipation: 63mW; Supplier 1: Digi-Key; Supplier Part Number 1: TC164J-22CT-ND; Value: 22R; Footprint Checked: -; Symbol Checked: -
T7 = T-Vishay-Si2365EDS: as T6 on sheet 02-POWER SUPPLY; MFG: VISHAY; MFG_PN: Si2365EDS-T1-GE3; Footprint Checked: -; Symbol Checked: -; Supplier 1: Digi-Key; Supplier Part Number 1: SI2365EDS-T1-GE3CT-ND
T8 = T-Vishay-SI-1024X: Mosfet Array 2 N-Channel (Dual) 20V 485mA 250mW Surface Mount SC-89-6; MFG: Vishay; MFG_PN: SI-1024-X; Supplier 1: Digi-Key; Supplier Part Number 1: SI1024X-T1-GE3CT-ND; Footprint Checked: -; Symbol Checked: -
TQ1 TQ2 = MECH-Wurth-9774040243R: ROUND STANDOFF M2X0.4 STEEL 4MM; MFG: Wurth; Footprint Checked: -; Symbol Checked: -; MFG_PN: 9774040243R; Supplier 1: Digi-Key; Supplier Part Number 1: 732-7090-1-ND
U5 U7 = D-DZQA5V6AXV5: 13V Clamp 2.5A (8/20µs) Ipp Tvs Diode Surface Mount 5-TSSOP; FP_DESC: SOT553; MFG: DIODES; Symbol Checked: Ok; MFG_PN: DZQA5V6AXV5; Footprint Checked: Assign OK, Footprint OK; Supplier 1: Digi-Key; Supplier Part Number 1: DZQA5V6AXV5DICT-ND
U6 = IC-NXP-NX3DV2567: Networking Switch IC 1 Channel 16-XQFN (1.8x2.6); MFG: NXP; Symbol Checked: D; MFG_PN: NX3DV2567GU,115; Footprint Checked: -; FP_DESC: XFQFN-16; Supplier 1: Digi-Key; Supplier Part Number 1: 568-5206-1-ND
U8 U9 = CON-Molex-115I-AEAA: MICRO SIM PUSH-PUSH, 6P, SMT, 1.; FP_DESC: microSIM card holder; MFG: GCT; Symbol Checked: Ok; Replacement Allowed: Ask; MFG_PN: SIM7050-6-0-00-A; Footprint Checked: Assign OK, Footprint OK; Supplier 1: Digi-Key; Supplier Part Number 1: 2073-SIM7050-6-0-00-ACT-ND
U12 = IC-ST-ST4SIM-200M: ESIM SYSTEM ON CHIP FOR M2M INDU; MFG: STMicroelectronics; MFG_PN: ST4SI2M0004TPIFW; Type: DEV; Footprint Checked: -; Symbol Checked: -